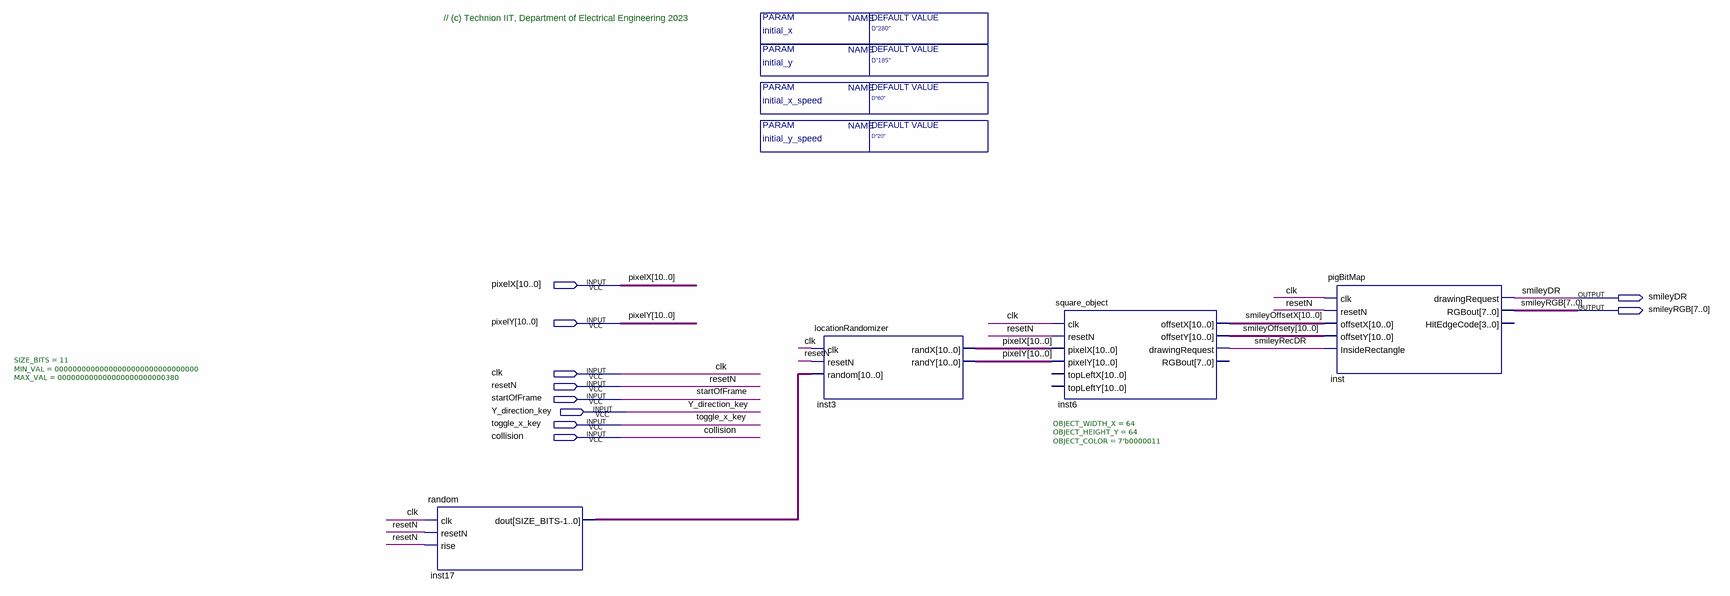
[diagram p0: schematic sheet]
// Quartus schematic Pig_Block_T.bdf as structural Verilog: 4 symbols, 10 pins
module Pig_Block_T #(parameter initial_x = "D\"280\"", parameter initial_y = "D\"185\"", parameter initial_x_speed = "D\"60\"", parameter initial_y_speed = "D\"20\"") (
  input  [10:0] pixelX,
  input  [10:0] pixelY,
  input  clk,
  input  resetN,
  input  startOfFrame,
  input  Y_direction_key,
  input  toggle_x_key,
  input  collision,
  output smileyDR,
  output [7:0] smileyRGB
);

  wire smileyRecDR;
  wire [10:0] inst17_dout, smileyOffsetX, smileyOffsety;

  random #(.SIZE_BITS(11), .MIN_VAL(00000000000000000000000000000000), .MAX_VAL(000000000000000000000000380)) inst17 (
    .clk(clk), .resetN(resetN), .rise(resetN), .dout(inst17_dout));
  locationRandomizer inst3 (.clk(clk), .resetN(resetN), .random(inst17_dout), .randX(pixelX), .randY(pixelY));
  square_object #(.OBJECT_WIDTH_X(64), .OBJECT_HEIGHT_Y(64), .OBJECT_COLOR(7'b0000011)) inst6 (
    .clk(clk), .resetN(resetN), .pixelX(pixelX), .pixelY(pixelY), .offsetX(smileyOffsetX),
    .offsetY(smileyOffsety), .drawingRequest(smileyRecDR));  // open: topLeftX, topLeftY, RGBout
  pigBitMap inst (
    .clk(clk), .resetN(resetN), .offsetX(smileyOffsetX), .offsetY(smileyOffsety),
    .InsideRectangle(smileyRecDR), .drawingRequest(smileyDR), .RGBout(smileyRGB));  // open: HitEdgeCode

  // Notes on the sheet:
  //   // (c) Technion IIT, Department of Electrical Engineering 2023
endmodule
